# Altium schematic sheet esp32.SchDoc
size A4; DocumentNumber: 2; SheetNumber: 2; SheetTotal: 5
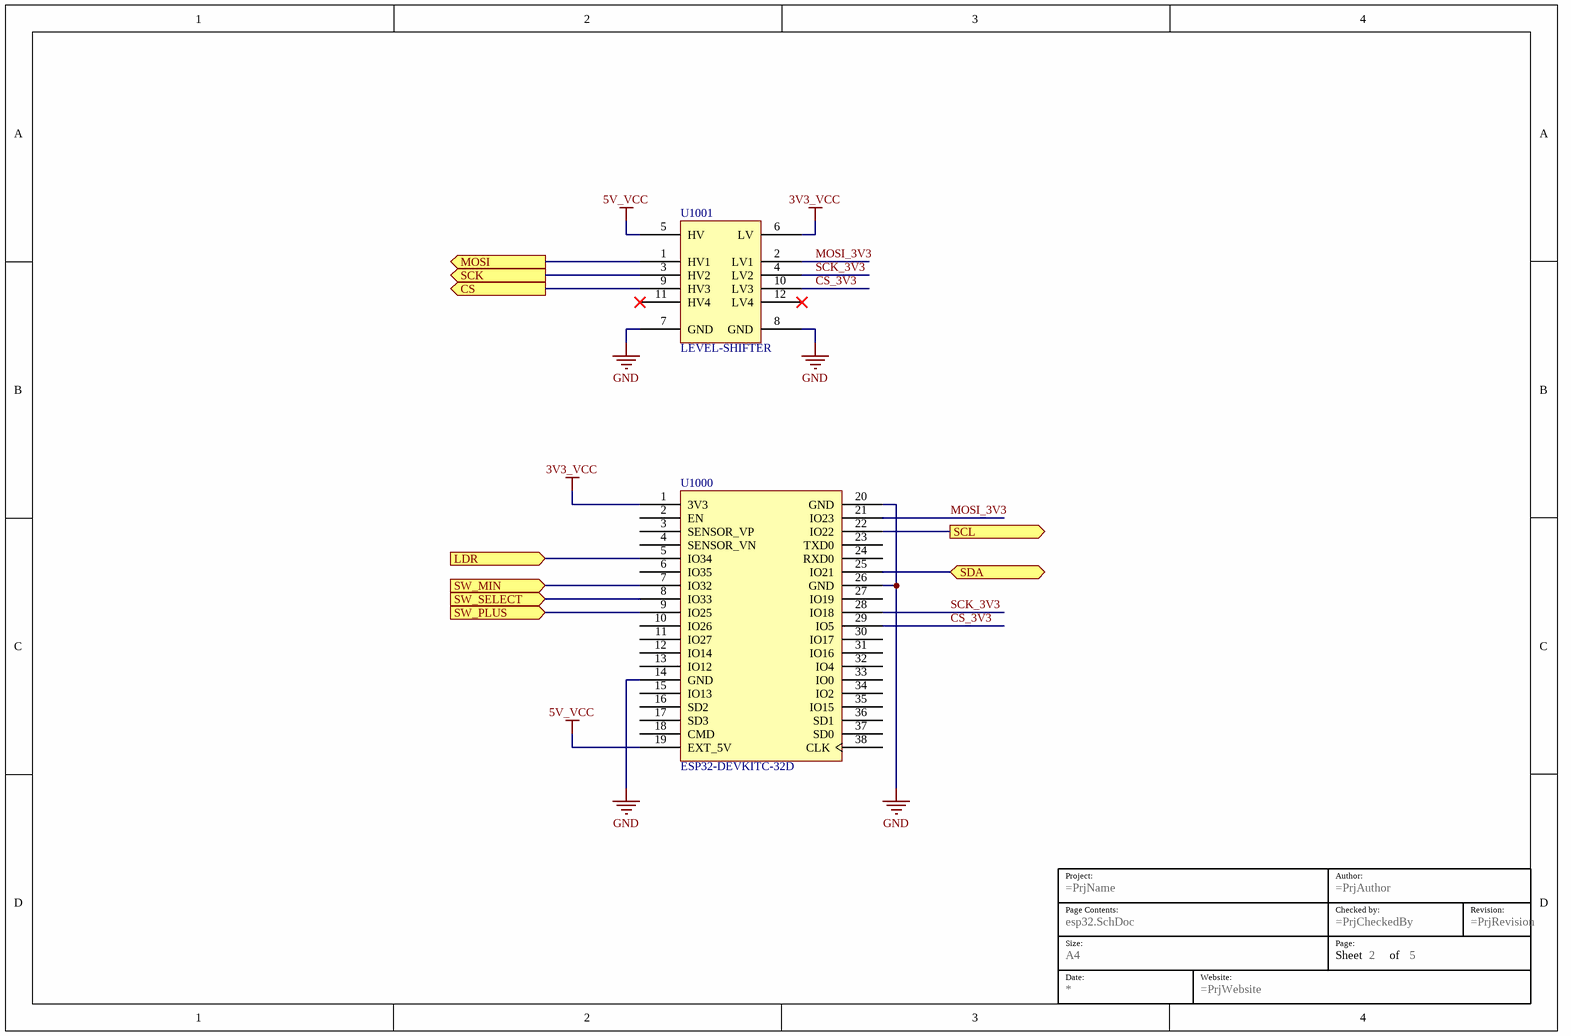
[diagram p0: esp32.SchDoc]

## Parts
*?  Size: A4  (hidden comment: TITLE BLOCK)  (graphical)
U1000  ESP32-DEVKITC-32D  [ESP32-DEVKITC-32D]
U1001  LEVEL-SHIFTER  [LEVEL-SHIFTER]

## Ports
CS (out), LDR (in), MOSI (out), SCK (out), SCL (out), SDA (bidir), SW_MIN (in), SW_PLUS (in), SW_SELECT (in)

## Nets
3V3_VCC: U1000.1(3V3) U1001.6(LV)
5V_VCC: U1000.19(EXT_5V) U1001.5(HV)
GND: U1000.14(GND) U1000.20(GND) U1000.26(GND) U1001.7(GND) U1001.8(GND)
CS: U1001.9(HV3) ; port CS
CS_3V3: U1000.29(IO5) U1001.10(LV3)
LDR: U1000.5(IO34) ; port LDR
MOSI: U1001.1(HV1) ; port MOSI
MOSI_3V3: U1000.21(IO23) U1001.2(LV1)
SCK: U1001.3(HV2) ; port SCK
SCK_3V3: U1000.28(IO18) U1001.4(LV2)
SCL: U1000.22(IO22) ; port SCL
SDA: U1000.25(IO21) ; port SDA
SW_MIN: U1000.7(IO32) ; port SW_MIN
SW_PLUS: U1000.9(IO25) ; port SW_PLUS
SW_SELECT: U1000.8(IO33) ; port SW_SELECT

Not connected (* = marked no-connect by the designer): U1000 2(EN) 3(SENSOR_VP) 4(SENSOR_VN) 6(IO35) 10(IO26) 11(IO27) 12(IO14) 13(IO12) 15(IO13) 16(SD2) 17(SD3) 18(CMD) 23(TXD0) 24(RXD0) 27(IO19) 30(IO17) 31(IO16) 32(IO4) 33(IO0) 34(IO2) 35(IO15) 36(SD1) 37(SD0) 38(CLK); U1001 11(HV4)* 12(LV4)*

## Notes on the sheet
- (in symbol TITLE BLOCK) Project:; Author:; Page Contents:; Checked by:; Revision:; Size:; Page:; Sheet; of; Date:; Website:

## Library data of the parts
U1000 = ESP32-DEVKITC-32D: MF: Espressif Systems; Package: None; Price: None; Availability: Unavailable; MP: ESP32-DEVKITC-32D; SnapEDA_Link: https://www.snapeda.com/parts/ESP32-DEVKITC-32D/Espressif%20Systems/view-part/2777395/?ref=snap; Value: *
U1001 = LEVEL-SHIFTER: BI-DIRECTIONAL LEVEL SHIFTER